# EAGLE design XStepper Opto-Isolator ADuM1301 v001 (EAGLE 6.4)
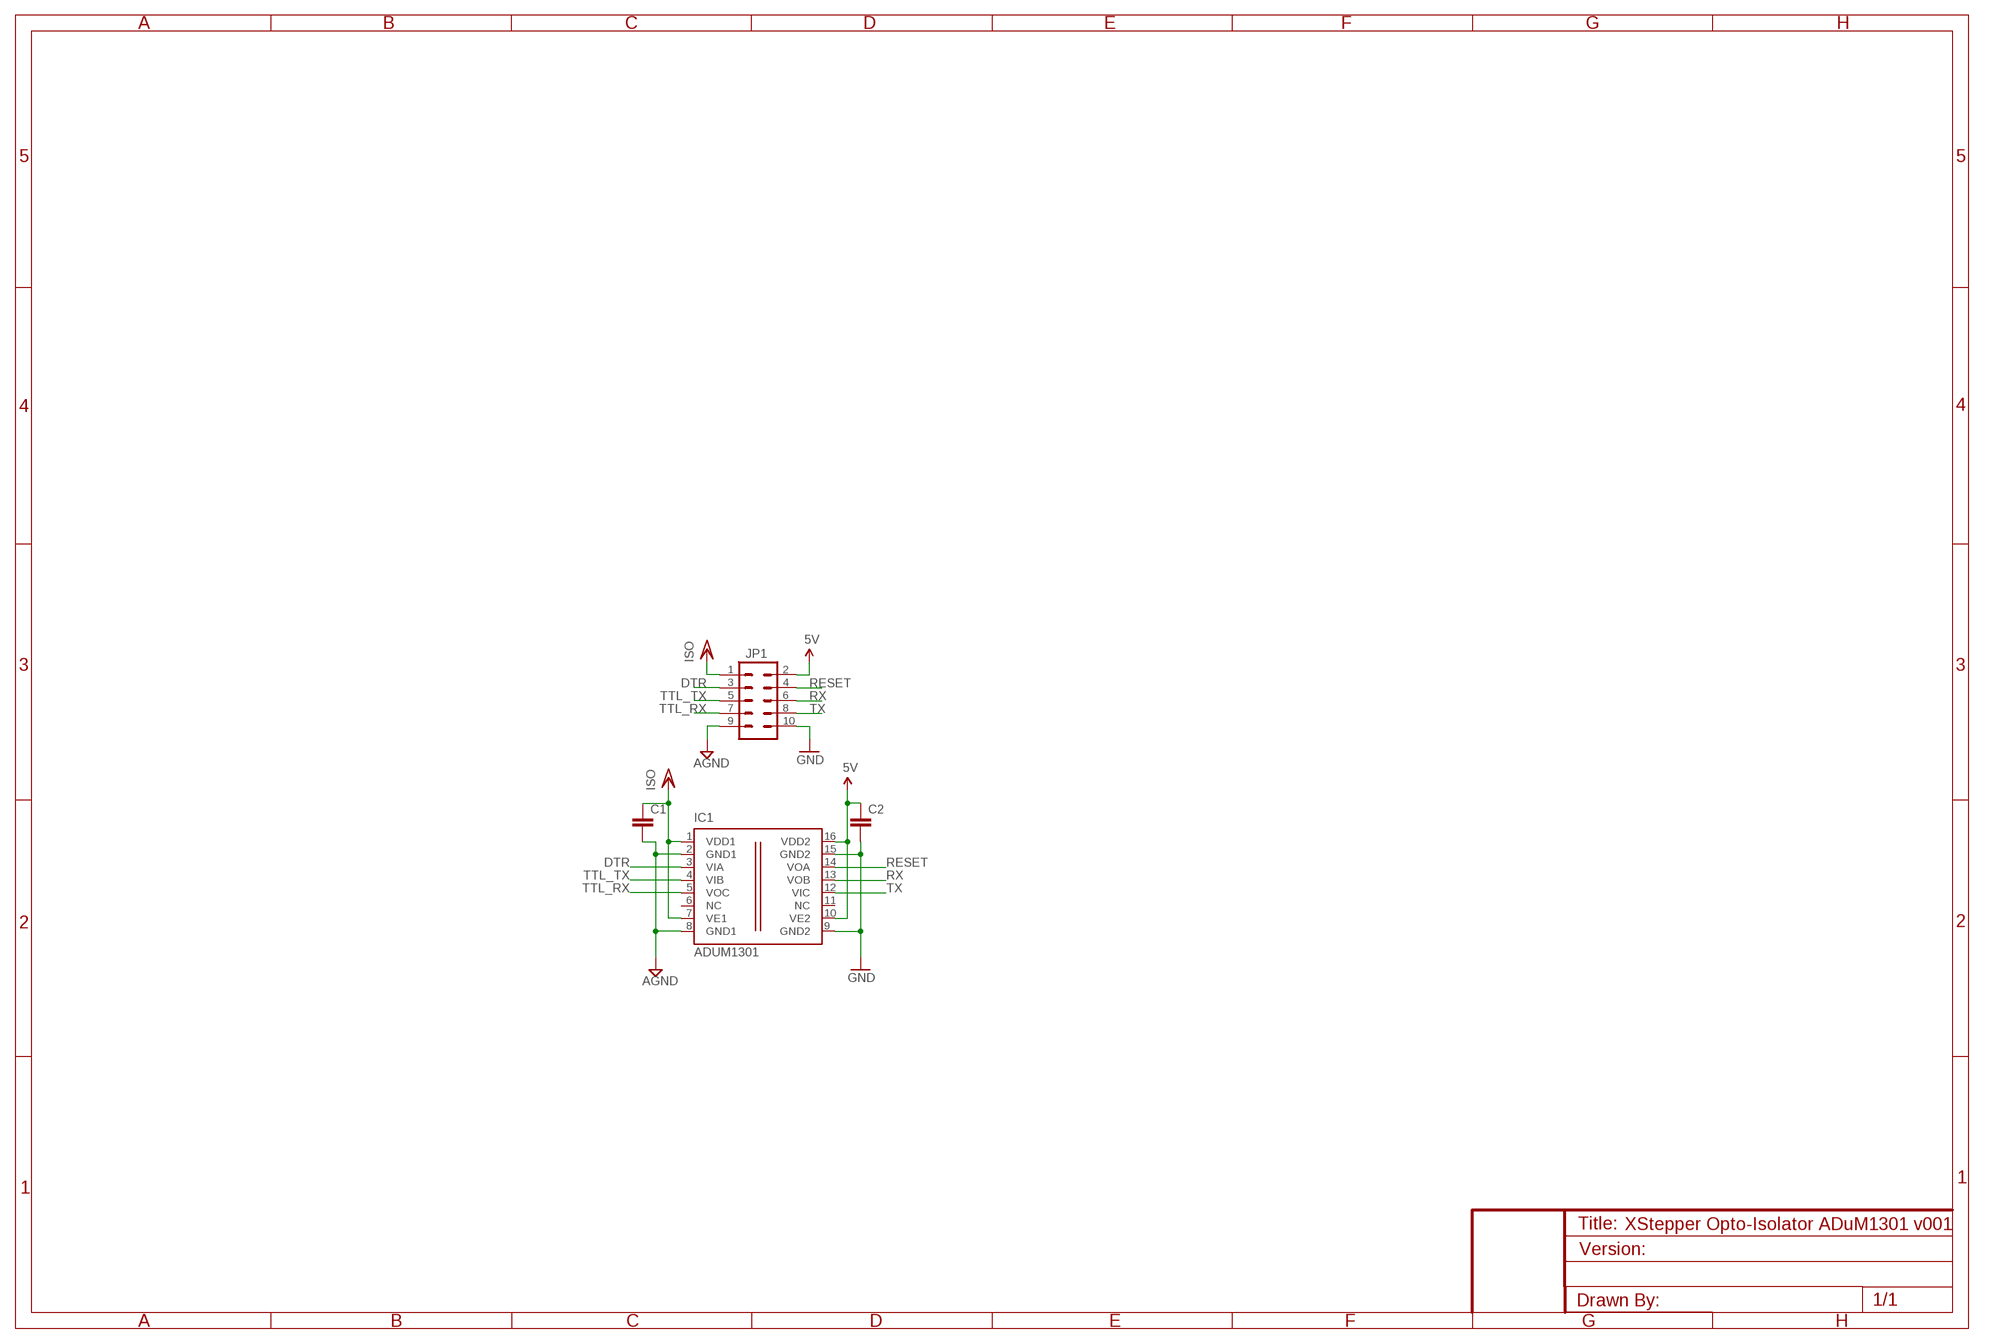
[diagram p0: schematic, sheet 1]

## Parts
C1  CAP0805  [0805]
C2  CAP0805  [0805]
IC1  ADUM1301  [SO-16W]
JP1  M05X2PTH  [AVR_ICSP]

## Nets
5V: C2.1 IC1.10(VE2) IC1.16(VDD2) JP1.2
AGND [power]: C1.2 IC1.2(GND1) IC1.8(GND1) JP1.9
DTR: IC1.3(VIA) JP1.3
GND [power]: C2.2 IC1.9(GND2) IC1.15(GND2) JP1.10
RESET: IC1.14(VOA) JP1.4
RX: IC1.13(VOB) JP1.6
TTL_RX: IC1.5(VOC) JP1.7
TTL_TX: IC1.4(VIB) JP1.5
TX: IC1.12(VIC) JP1.8
VCC/2: C1.1 IC1.1(VDD1) IC1.7(VE1) JP1.1 ; supply symbol labelled ISO
Unconnected: IC1.6(NC) IC1.11(NC)

## Library data of the parts
C1 C2 = SparkFun-Capacitors:CAP: Capacitor Standard 0603 ceramic capacitor, and 0.1" leaded capacitor.
IC1 = analog-devices:ADUM1301: Triple-Channel Digital Isolators Source: http://www.analog.com/static/imported-files/data_sheets/ADuM1300_1301.pdf; MPN: ADUM1301BRWZ; OC_FARNELL: 1465623; OC_NEWARK: 19M0757
JP1 = SparkFun-Connectors:M05X2: Header 5x2 Standard 10-pin dual row 0.1" header. Commonly used with AVR-ISP. Use with Spark Fun Electronics SKU: PRT-00778

## Net classes
0 default: width 0.254 mm, clearance 0.355 mm
1 power: width 1.016 mm, clearance 0.355 mm to class 0, clearance 0.355 mm

## Board
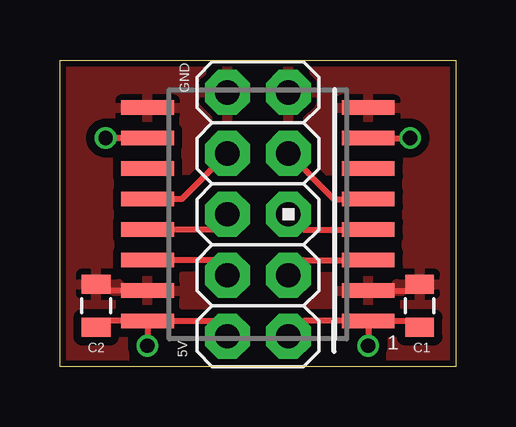
[diagram p1: board, top side]
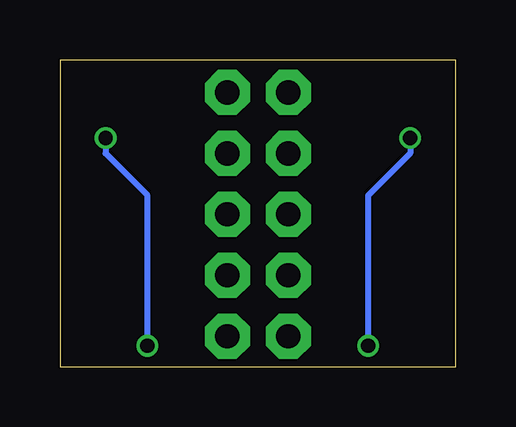
[diagram p2: board, bottom side, seen from below]

Size 16.51 x 12.78 mm. Coordinates in mm from the lower left corner, seen from the top.
Outline: 0,0 0,12.78 16.51,12.78 16.51,0 0,0
Copper layers (1*16): Top 0.035mm / dielectric 1.5mm / Bottom 0.035mm
Design rules "ITEADstudio_DRC": minimum track width 6mil, minimum drill 12mil, track to track 6mil, track to pad 6mil, pad to pad 6mil, via to via 6mil, smd to smd 0mil, copper to edge 10mil, drill to drill 10mil, minimum pad ring 10mil, minimum via ring 6mil, stop-mask expansion 2mil, vias tented up to drill 100mil, thermal gap 10mil

### Footprints (pad centres in the part's own frame; a part is rotated, then mirrored left to right if it is on the bottom)
0805 = smd 0.8 x 1.2: 1 -0.9,0; 2 0.9,0
SO-16W = smd 0.6 x 2.2: 1 -4.445,-4.6; 2 -3.175,-4.6; 3 -1.905,-4.6; 4 -0.635,-4.6; 5 0.635,-4.6; 6 1.905,-4.6; 7 3.175,-4.6; 8 4.445,-4.6; 9 4.445,4.6; 10 3.175,4.6; 11 1.905,4.6; 12 0.635,4.6; 13 -0.635,4.6; 14 -1.905,4.6; 15 -3.175,4.6; 16 -4.445,4.6
AVR_ICSP = drill 1.016 pad 1.88 octagon: 1 -1.27,5.08; 2 1.27,5.08; 3 -1.27,2.54; 4 1.27,2.54; 5 -1.27,0; 6 1.27,0; 7 -1.27,-2.54; 8 1.27,-2.54; 9 -1.27,-5.08; 10 1.27,-5.08

### Placement (x,y rotation side)
C1  15,2.54 90 top
C2  1.51,2.54 90 top
IC1  8.26,6.35 90 top
JP1  8.26,6.35 180 top

### Tracks (layer width: path | path; a pad name or v marks a point on that pad's centre or on a via)
5V  (via drill 0.6)
  Top 0.254: IC1.16 6.35,1.91 JP1.2 | IC1.16 1.77,1.91 C2.1 | IC1.16 v3.66,0.88 v3.65,0.87 | IC1.10 v1.91,9.52
  Bottom 0.254: v3.65,0.87 3.65,7.14 1.91,8.89 v1.91,9.52
AGND
  Top 0.254: IC1.2 14.74,3.17 C1.2
  pour Top: 9.53,-2.54 9.53,13.97 17.14,13.97 17.14,-2.54
DTR
  Top 0.254: JP1.3 10.16,4.45 IC1.3
GND
  Top 0.254: IC1.15 1.77,3.17 C2.2
  pour Top: 6.99,-2.54 -0.64,-2.54 -0.64,13.97 6.99,13.97
RESET
  Top 0.254: JP1.4 6.35,4.45 IC1.14
RX
  Top 0.254: JP1.6 6.35,5.72 IC1.13
TTL_RX
  Top 0.254: JP1.7 11.43,6.99 IC1.5
TTL_TX
  Top 0.254: JP1.5 10.16,5.72 IC1.4
TX
  Top 0.254: JP1.8 5.08,6.99 IC1.12
VCC/2  (via drill 0.6)
  Top 0.254: IC1.1 10.16,1.91 JP1.1 | IC1.1 14.74,1.91 C1.1 | IC1.7 v14.61,9.52 | IC1.1 12.86,1.19 v12.86,0.87
  Bottom 0.254: v14.61,9.52 14.61,8.89 13.22,7.5 | 13.22,7.5 12.86,7.14 | v12.86,0.87 12.86,7.14 | 12.86,7.14 13.22,7.5

### Text on the board
tNames: GND | 5V | 1